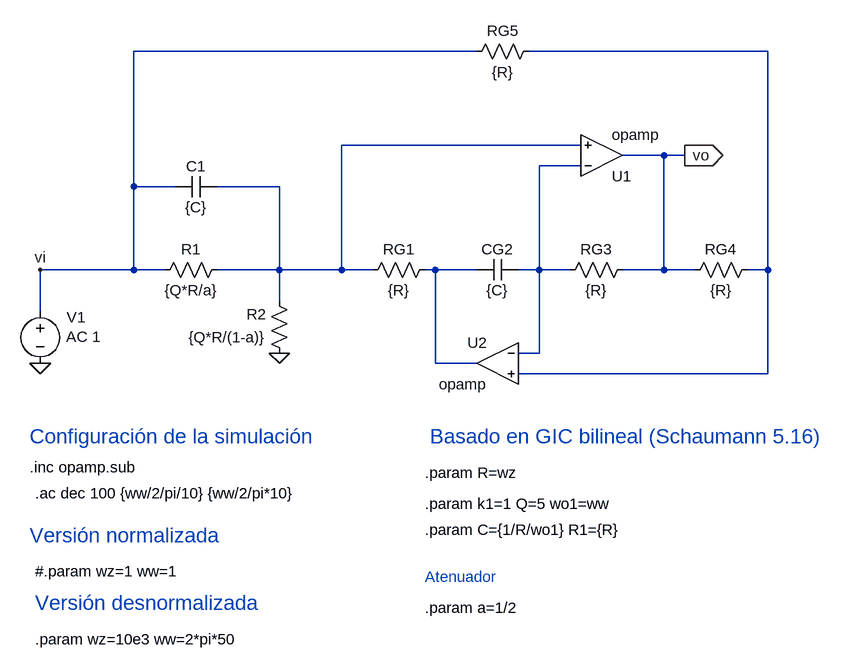
[diagram p0: schematic GIC-Fliege highpass notch.ASC.asc]
GIC-Fliege highpass notch.ASC.asc, the LTspice schematic file:
Version 4
SHEET 1 2616 808
WIRE 320 -160 -208 -160
WIRE 768 -160 400 -160
WIRE 480 -16 112 -16
WIRE 608 0 544 0
WIRE 640 0 608 0
WIRE 480 16 416 16
WIRE -208 48 -208 -160
WIRE -144 48 -208 48
WIRE 16 48 -80 48
WIRE -208 176 -208 48
WIRE -208 176 -352 176
WIRE -160 176 -208 176
WIRE 16 176 16 48
WIRE 16 176 -80 176
WIRE 112 176 112 -16
WIRE 112 176 16 176
WIRE 160 176 112 176
WIRE 256 176 240 176
WIRE 320 176 256 176
WIRE 416 176 416 16
WIRE 416 176 384 176
WIRE 464 176 416 176
WIRE 608 176 608 0
WIRE 608 176 544 176
WIRE 656 176 608 176
WIRE 768 176 768 -160
WIRE 768 176 736 176
WIRE 16 224 16 176
WIRE -352 240 -352 176
WIRE 416 304 416 176
WIRE 416 304 384 304
WIRE 256 320 256 176
WIRE 320 320 256 320
WIRE 768 336 768 176
WIRE 768 336 384 336
FLAG -352 320 0
FLAG -352 176 vi
FLAG 16 304 0
FLAG 640 0 vo
IOPIN 640 0 Out
SYMBOL res -64 160 R90
WINDOW 0 0 56 VBottom 2
WINDOW 3 32 56 VTop 2
SYMATTR InstName R1
SYMATTR Value {Q*R/a}
SYMBOL res 144 192 R270
WINDOW 0 32 56 VTop 2
WINDOW 3 0 56 VBottom 2
SYMATTR InstName RG1
SYMATTR Value {R}
SYMBOL res 448 192 R270
WINDOW 0 32 56 VTop 2
WINDOW 3 0 56 VBottom 2
SYMATTR InstName RG3
SYMATTR Value {R}
SYMBOL res 640 192 R270
WINDOW 0 32 56 VTop 2
WINDOW 3 0 56 VBottom 2
SYMATTR InstName RG4
SYMATTR Value {R}
SYMBOL res 416 -176 R90
WINDOW 0 0 56 VBottom 2
WINDOW 3 32 56 VTop 2
SYMATTR InstName RG5
SYMATTR Value {R}
SYMBOL cap -144 64 R270
WINDOW 0 32 32 VTop 2
WINDOW 3 0 32 VBottom 2
SYMATTR InstName C1
SYMATTR Value {C}
SYMBOL cap 320 192 R270
WINDOW 0 32 32 VTop 2
WINDOW 3 0 32 VBottom 2
SYMATTR InstName CG2
SYMATTR Value {C}
SYMBOL OpAmps\\opamp 512 64 M180
SYMATTR InstName U1
SYMBOL OpAmps\\opamp 352 256 M0
SYMATTR InstName U2
SYMBOL voltage -352 224 R0
WINDOW 123 40 55 Left 2
WINDOW 39 0 0 Left 0
WINDOW 0 41 25 Left 2
SYMATTR Value2 AC 1
SYMATTR InstName V1
SYMATTR Value ""
SYMBOL res 32 320 R180
WINDOW 0 36 76 Left 2
WINDOW 3 36 40 Left 2
SYMATTR InstName R2
SYMATTR Value {Q*R/(1-a)}
TEXT -368 480 Left 2 !.inc opamp.sub
TEXT -360 520 Left 2 !.ac dec 100 {ww/2/pi/10} {ww/2/pi*10}
TEXT 240 536 Left 2 !.param k1=1 Q=5 wo1=ww
TEXT -360 744 Left 2 !.param wz=10e3 ww=2*pi*50
TEXT -368 584 Left 3 ;Versión normalizada
TEXT -360 688 Left 3 ;Versión desnormalizada
TEXT 240 576 Left 2 !.param C={1/R/wo1} R1={R}
TEXT -360 640 Left 2 !#.param wz=1 ww=1
TEXT 240 488 Left 2 !.param R=wz
TEXT -368 432 Left 3 ;Configuración de la simulación
TEXT 240 648 Left 2 ;Atenuador
TEXT 240 696 Left 2 !.param a=1/2
TEXT 248 432 Left 3 ;Basado en GIC bilineal (Schaumann 5.16)

The netlist it stands for:
* GIC-Fliege highpass notch.ASC.asc
R1 N002 vi {Q*R/a}
RG1 N002 N004 {R}
RG3 N003 vo {R}
RG4 vo N001 {R}
RG5 N001 vi {R}
C1 vi N002 {C}
CG2 N004 N003 {C}
XU1 N003 N002 vo opamp Aol=100K GBW=10Meg  ; pins invin noninvin out
XU2 N003 N001 N004 opamp Aol=100K GBW=10Meg  ; pins invin noninvin out
V1 vi 0 AC 1
R2 0 N002 {Q*R/(1-a)}
.inc opamp.sub
.ac dec 100 {ww/2/pi/10} {ww/2/pi*10}
.param k1=1 Q=5 wo1=ww
.param wz=10e3 ww=2*pi*50
* Versión normalizada
* Versión desnormalizada
.param C={1/R/wo1} R1={R}
#.param wz=1 ww=1
.param R=wz
* Configuración de la simulación
* Atenuador
.param a=1/2
* Basado en GIC bilineal (Schaumann 5.16)
.backanno
.end